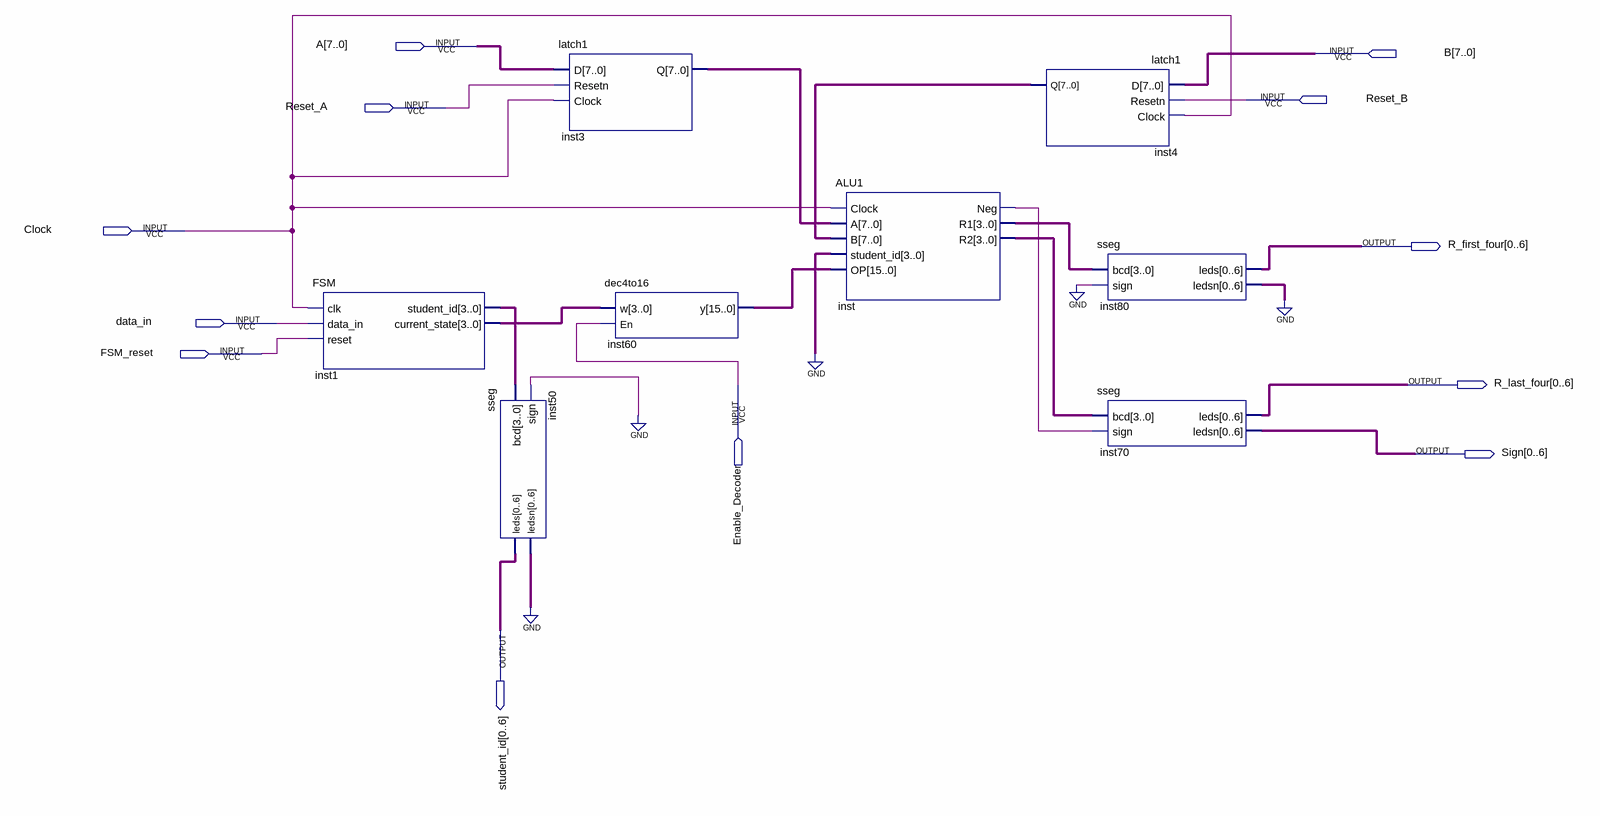
[diagram p0: schematic sheet]
// Quartus schematic Problem1.bdf as structural Verilog: 8 symbols, 12 pins
module Problem1 (
  input  [7:0] A,
  input  [7:0] B,
  input  Reset_B,
  input  Reset_A,
  input  Clock,
  input  data_in,
  input  FSM_reset,
  input  Enable_Decoder,
  output [0:6] R_first_four,
  output [0:6] R_last_four,
  output [0:6] Sign,
  output [0:6] student_id
);

  wire inst_neg;
  wire [3:0] inst1_current_state, inst1_student_id, inst_r1, inst_r2;
  wire [6:0] inst50_ledsn, inst80_ledsn;
  wire [7:0] inst3_q, inst4_q;
  wire [15:0] inst60_y;

  FSM inst1 (
    .clk(Clock), .data_in(data_in), .reset(FSM_reset), .student_id(inst1_student_id),
    .current_state(inst1_current_state));
  sseg inst50 (.bcd(inst1_student_id), .sign(1'b0), .leds(student_id), .ledsn(inst50_ledsn));
  latch1 inst3 (.D(A), .Resetn(Reset_A), .Clock(Clock), .Q(inst3_q));
  dec4to16 inst60 (.w(inst1_current_state), .En(Enable_Decoder), .y(inst60_y));
  ALU1 inst (
    .Clock(Clock), .A(inst3_q), .B(inst4_q), .student_id(4'b0000), .OP(inst60_y), .Neg(inst_neg),
    .R1(inst_r1), .R2(inst_r2));
  latch1 inst4 (.D(B), .Resetn(Reset_B), .Clock(Clock), .Q(inst4_q));
  sseg inst80 (.bcd(inst_r1), .sign(1'b0), .leds(R_first_four), .ledsn(inst80_ledsn));
  sseg inst70 (.bcd(inst_r2), .sign(inst_neg), .leds(R_last_four), .ledsn(Sign));
  // also tied to GND on the sheet: {inst50_ledsn[0], inst50_ledsn[1], inst50_ledsn[2], inst50_ledsn[3], inst50_ledsn[4], inst50_ledsn[5], inst50_ledsn[6], inst80_ledsn[0], inst80_ledsn[1], inst80_ledsn[2], inst80_ledsn[3], inst80_ledsn[4], inst80_ledsn[5], inst80_ledsn[6]}
endmodule
